# Altium project Boost_UC3843.PrjPcb
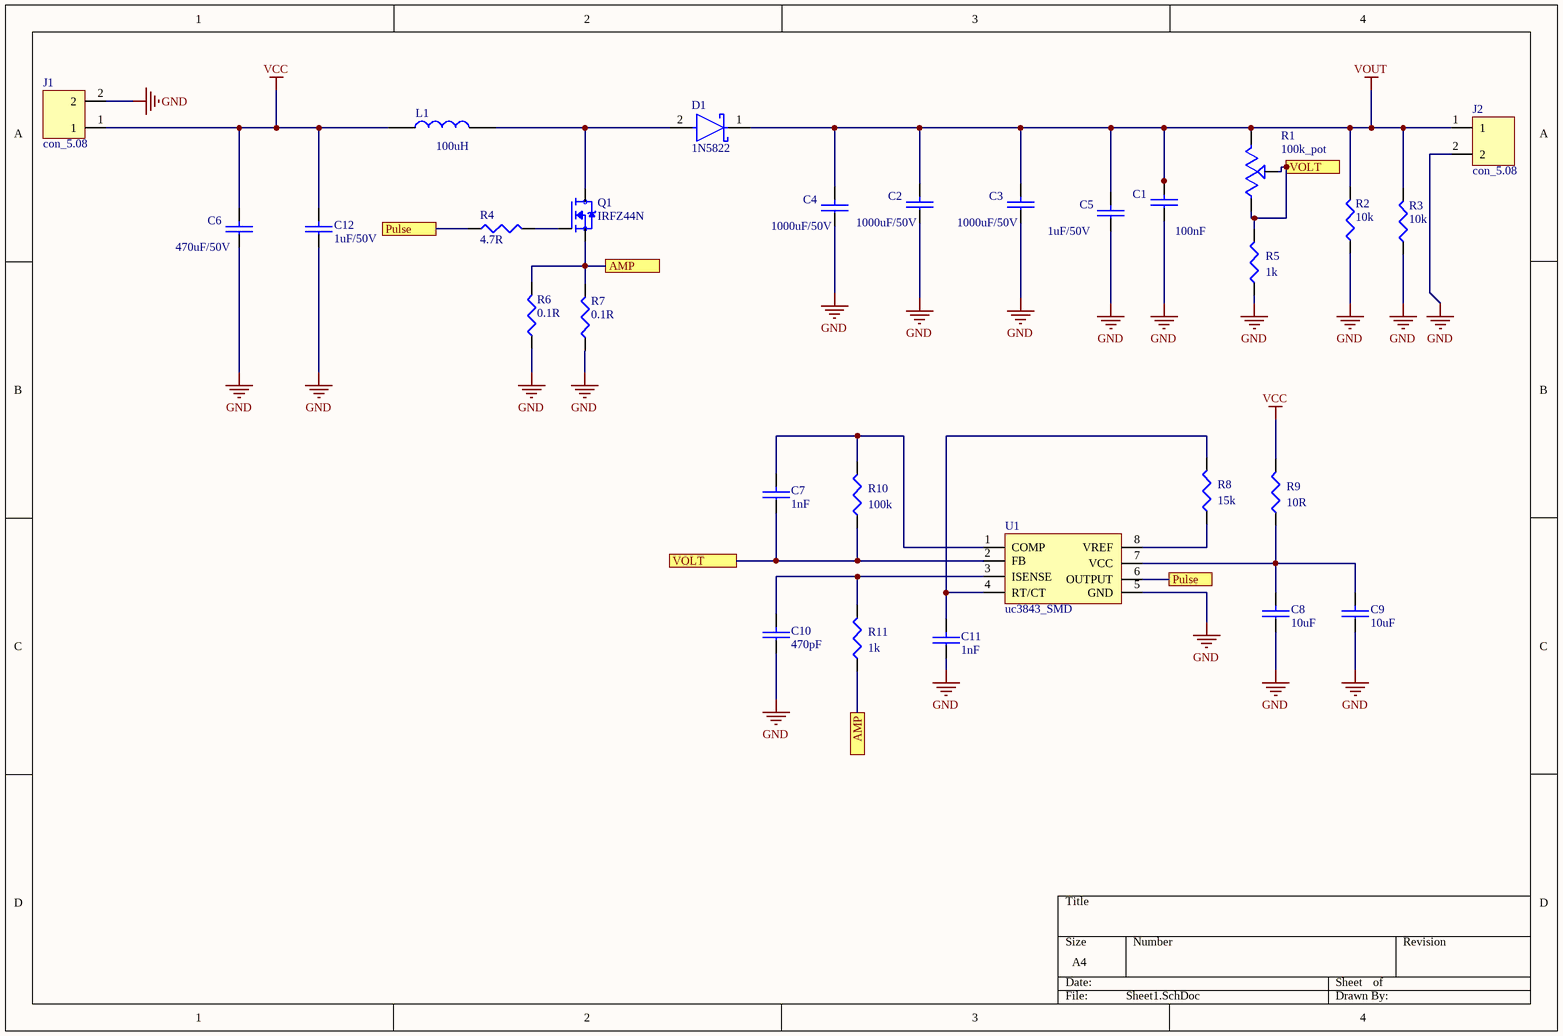
[diagram p0: Sheet1.SchDoc]
1 sheet, 29 parts. Net scope: flat (ports and power ports of the same name join across sheets).
Board files: PCB2.PcbDoc, PCB1.PcbDoc

## Sheet Sheet1.SchDoc
size A4

### Parts
C1  100nF  [C1206_2uF]
C2  1000uF/50V  [C1206_2uF]
C3  1000uF/50V  [C1206_2uF]
C4  1000uF/50V  [C1206_2uF]
C5  1uF/50V  [C1206_2uF]
C6  470uF/50V  [C1206_2uF]
C7  1nF  [C1206_2uF]
C8  10uF  [C1206_2uF]
C9  10uF  [C1206_2uF]
C10  470pF  [C1206_2uF]
C11  1nF  [C1206_2uF]
C12  1uF/50V  [C1206_2uF]
D1  1N5822  [15SQ045]
J1  con_5.08  [5.08_con_1]
J2  con_5.08  [5.08_con_1]
L1  100uH  [100uH_SMD]
Q1  IRFZ44N  [IRFZ44N]
R1  100k_pot  [pot_100k_1]
R2  10k  [R2512]
R3  10k  [R2512]
R4  4.7R  [1206_Res]
R5  1k  [1206_Res]
R6  0.1R  [2512]
R7  0.1R  [2512]
R8  15k  [1206_Res]
R9  10R  [1206_Res]
R10  100k  [1206_Res]
R11  1k  [1206_Res]
U1  uc3843_SMD  [uc3843_SOIC8]

### Ports
AMP, Pulse, VOLT

### Nets
GND: C1.1 C2.1 C3.1 C4.1 C5.1 C6.1 C8.1 C9.1 C10.1 C11.1 C12.1 J1.2 J2.2 R2.1 R3.1 R5.1 R6.1 R7.1 U1.5(GND)
VCC: C6.2 C12.2 J1.1 L1.1 R9.2
VOUT: C1.2 C2.2 C3.2 C4.2 C5.2 D1.1(K) J2.1 R1.3(C) R2.2 R3.2
NetC7_1: C7.1 R1.1(A) R1.2(B) R5.2 R10.1 U1.2(FB) ; port VOLT
NetC7_2: C7.2 R10.2 U1.1(COMP)
NetC8_2: C8.2 C9.2 R9.1 U1.7(VCC)
NetC10_2: C10.2 R11.2 U1.3(ISENSE)
NetC11_2: C11.2 R8.2 U1.4(RT/CT)
NetD1_2: D1.2(A) L1.2 Q1.2(D)
NetQ1_1: Q1.1(G) R4.2
NetQ1_3: Q1.3(S) R6.2 R7.2 R11.1 ; port AMP
NetR4_1: R4.1 U1.6(OUTPUT) ; port Pulse
NetR8_1: R8.1 U1.8(VREF)

### Library data of the parts
C1-C12 = C1206_2uf
D1 = 1N5822: Diode; Diode Type:Schottky; Repetitive Reverse Voltage Max, Vrrm:40V; Forward Current, If(AV):3A; Forward Surge Current Max, Ifsm:80A; Forward Voltage Max, VF:0.525V; Junction Temperature, Tj max:125°C ;RoHS Compliant: Yes /
Q1 = IRFZ44N: N-Channel 55 V 49A (Tc) 94W (Tc) Through Hole TO-220AB
R2 R3 = R2512_1W
R4 R5 R8-R11 = 1206
R6 R7 = 2512